# EAGLE design radio (EAGLE 5.11)
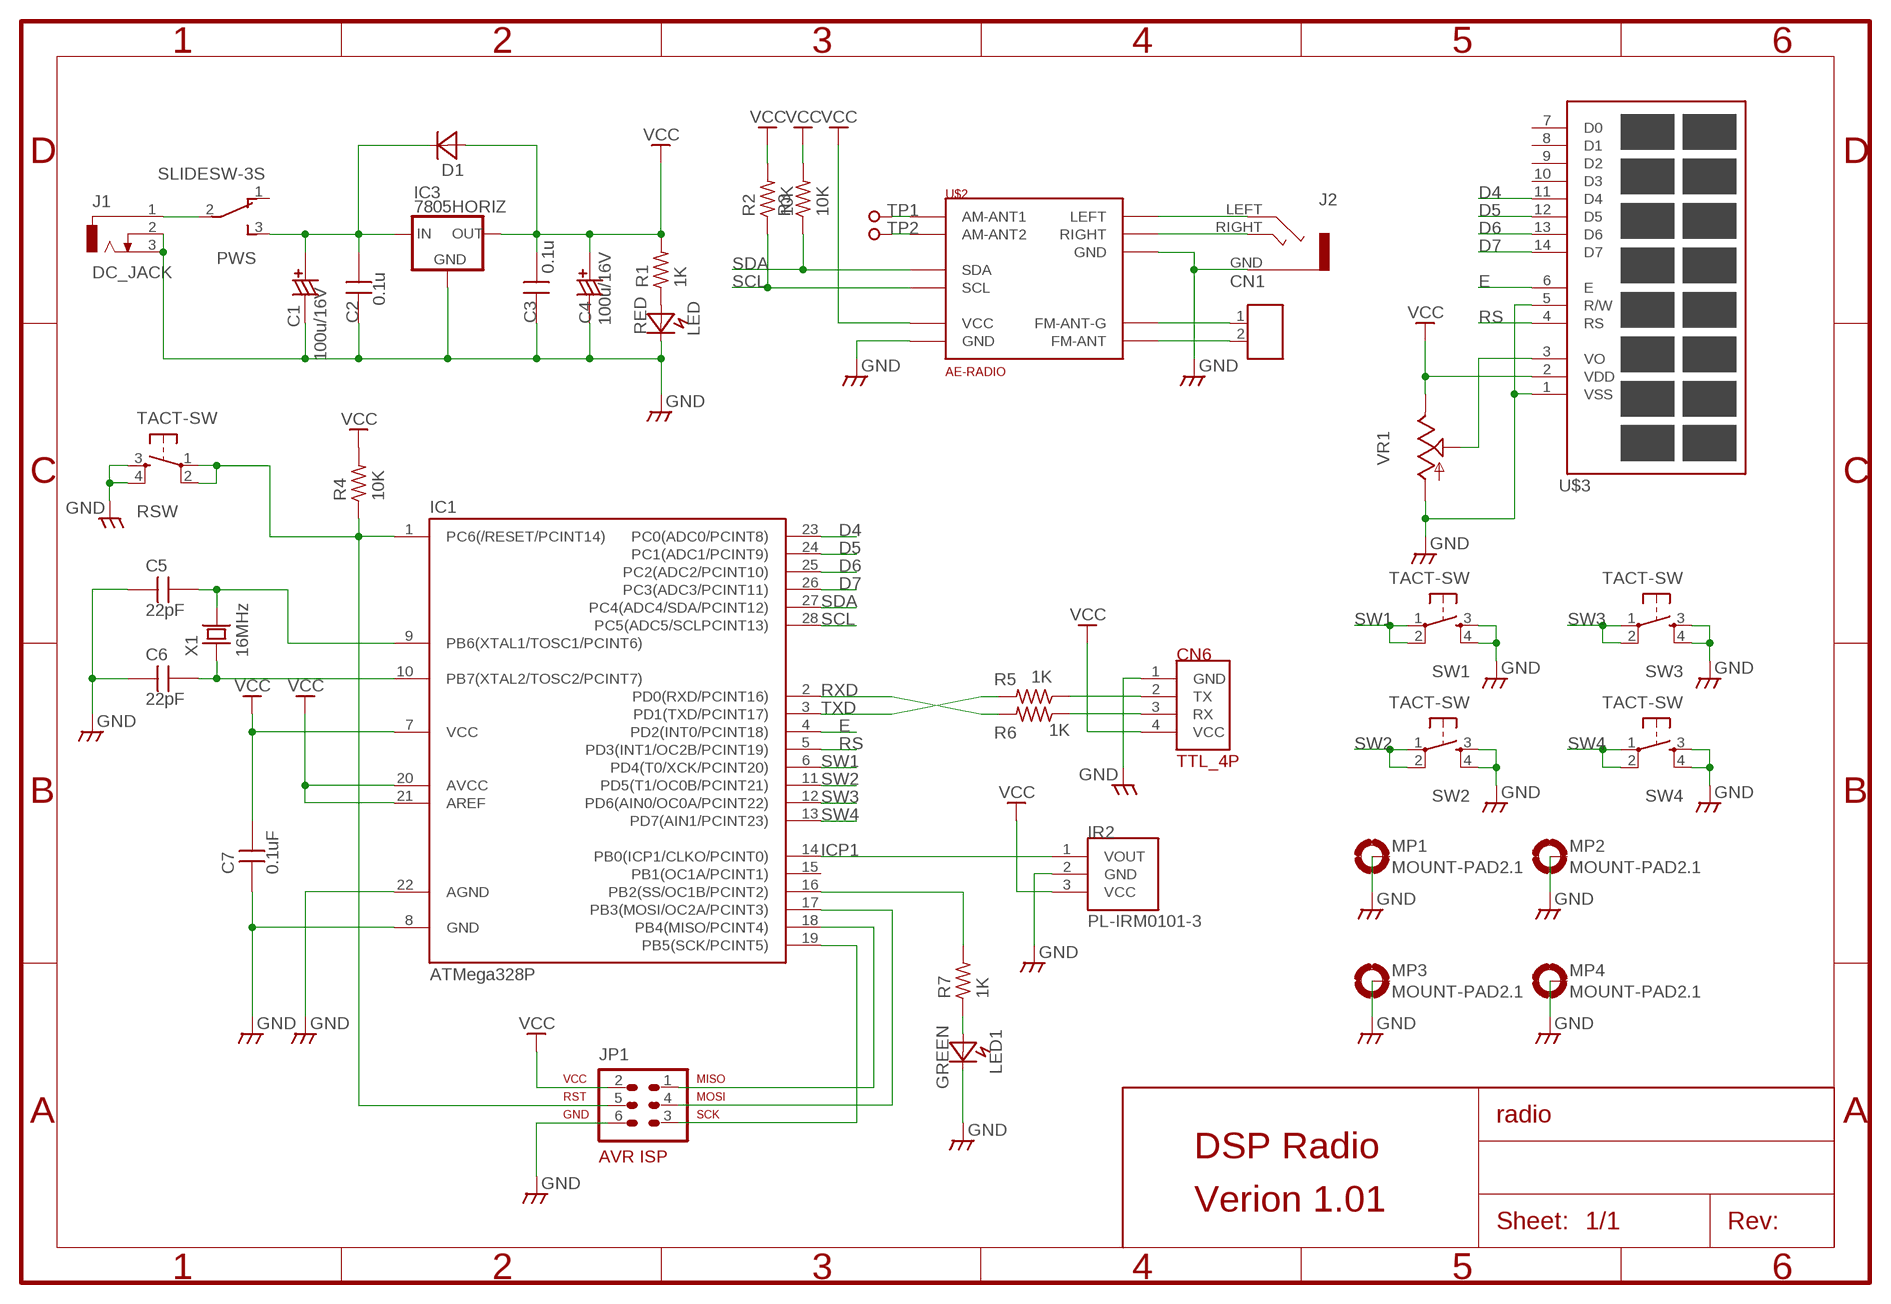
[diagram p0: schematic, sheet 1]

## Parts
C1  100u/16V  CCAP6.5  [CCAP_6.5]
C2  0.1u  CAPDIP_1  [CAP_DIP_1]
C3  0.1u  CAPDIP_1  [CAP_DIP_1]
C4  100u/16V  CCAP6.5  [CCAP_6.5]
C5  22pF  CAPDIP_1  [CAP_DIP_1]
C6  22pF  CAPDIP_1  [CAP_DIP_1]
C7  0.1uF  CAPDIP_2  [CAP_DIP_2]
CN1  CON_2P  [CON_HRS_DIP_2]
CN6  TTL_4P  [CON_HRS_DIP_4]
D1  DIODEGENERIC_2  [DIODE_2]
IC1  ATMega328P  MEGA48/88/168/328-PU  [DIL28-3]
IC3  7805HORIZ  [TO220H]
IR2  PL-IRM0101-3  PL-IRM0208  [PL-IRM0208]
J1  DC_JACK  [DCJ0202]
J2  MINIJACK  [MINIJACK]
JP1  AVR-ISP-6  [AVR-ISP-6]
LED  RED  LED  [LED_3MM_VIRT_2]
LED1  GREEN  LED  [LED_3MM_VIRT_2]
MP1  MOUNT-PAD2.1  [PAD-2.1]
MP2  MOUNT-PAD2.1  [PAD-2.1]
MP3  MOUNT-PAD2.1  [PAD-2.1]
MP4  MOUNT-PAD2.1  [PAD-2.1]
PWS  SLIDESW-3S  [DS-3]
R1  1K  R0.125W_4P  [R_0.125W_4]
R2  10K  R0.125W_4P  [R_0.125W_4]
R3  10K  R0.125W_4P  [R_0.125W_4]
R4  10K  R0.125W_4P  [R_0.125W_4]
R5  1K  R0.125W_4P  [R_0.125W_4]
R6  1K  R0.125W_4P  [R_0.125W_4]
R7  1K  R0.125W_4P  [R_0.125W_4]
RSW  TACT-SW  [B3F-10X]
SW1  TACT-SW  [B3F-10X]
SW2  TACT-SW  [B3F-10X]
SW3  TACT-SW  [B3F-10X]
SW4  TACT-SW  [B3F-10X]
TP1  TP1R  [TP1]
TP2  TP1R  [TP1]
U$2  AE-RADIO  [AE-RADIO]
U$3  ACM0802C_2  [ACM0802C_2]
VR1  POTMIDDLE  [POT_MIDDLE]
X1  16MHz  XTAL49S  [HC49/S]

## Nets
D4: IC1.23(PC0(ADC0/PCINT8)) U$3.11(D4)
D5: IC1.24(PC1(ADC1/PCINT9)) U$3.12(D5)
D6: IC1.25(PC2(ADC2/PCINT10)) U$3.13(D6)
D7: IC1.26(PC3(ADC3/PCINT11)) U$3.14(D7)
E: IC1.4(PD2(INT0/PCINT18)) U$3.6(E)
GND: C1.- C2.1 C3.1 C4.- C5.1 C6.1 C7.1 CN6.1(GND) IC1.8(GND) IC1.22(AGND) IC3.2(GND) IR2.2(GND) J1.2 J1.3 J2.GND JP1.6 LED1.K LED.K MP1.B2,1(MOUNT) MP2.B2,1(MOUNT) MP3.B2,1(MOUNT) MP4.B2,1(MOUNT) RSW.3(S) RSW.4(S1) SW1.3(S) SW1.4(S1) SW2.3(S) SW2.4(S1) SW3.3(S) SW3.4(S1) SW4.3(S) SW4.4(S1) U$2.GND@1(GND) U$2.GND@2(GND) U$3.1(VSS) U$3.5(R/W) VR1.A
ICP1: IC1.14(PB0(ICP1/CLKO/PCINT0)) IR2.1(VOUT)
LEFT: J2.LEFT U$2.LEFT
N$1: LED1.A R7.1
N$2: IC1.16(PB2(SS/OC1B/PCINT2)) R7.2
N$5: J1.1 PWS.2(P)
N$6: C6.2 IC1.10(PB7(XTAL2/TOSC2/PCINT7)) X1.1
N$7: LED.A R1.1
N$8: C1.+ C2.2 D1.K IC3.1(IN) PWS.3(S)
N$9: CN6.2(TX) R5.1
N$10: C5.2 IC1.9(PB6(XTAL1/TOSC1/PCINT6)) X1.2
N$11: CN1.1 U$2.FM-ANT-G
N$12: CN6.3(RX) R6.1
N$13: CN1.2 U$2.FM-ANT
N$14: TP1.P$1 U$2.AM-ANT1
N$15: TP2.P$1 U$2.AM-ANT2
N$16: U$3.3(VO) VR1.S
N$21: IC1.19(PB5(SCK/PCINT5)) JP1.3
N$22: IC1.18(PB4(MISO/PCINT4)) JP1.1
N$23: IC1.17(PB3(MOSI/OC2A/PCINT3)) JP1.4
RESET: IC1.1(PC6(/RESET/PCINT14)) JP1.5 R4.1 RSW.1(P) RSW.2(P1)
RIGHT: J2.RIGHT U$2.RIGHT
RS: IC1.5(PD3(INT1/OC2B/PCINT19)) U$3.4(RS)
RXD: IC1.2(PD0(RXD/PCINT16)) R6.2
SCL: IC1.28(PC5(ADC5/SCLPCINT13)) R2.1 U$2.SCL
SDA: IC1.27(PC4(ADC4/SDA/PCINT12)) R3.1 U$2.SDA
SW1: IC1.6(PD4(T0/XCK/PCINT20)) SW1.1(P) SW1.2(P1)
SW2: IC1.11(PD5(T1/OC0B/PCINT21)) SW2.1(P) SW2.2(P1)
SW3: IC1.12(PD6(AIN0/OC0A/PCINT22)) SW3.1(P) SW3.2(P1)
SW4: IC1.13(PD7(AIN1/PCINT23)) SW4.1(P) SW4.2(P1)
TXD: IC1.3(PD1(TXD/PCINT17)) R5.2
VCC: C3.2 C4.+ C7.2 CN6.4(VCC) D1.A IC1.7(VCC) IC1.20(AVCC) IC1.21(AREF) IC3.3(OUT) IR2.3(VCC) JP1.2 R1.2 R2.2 R3.2 R4.2 U$2.VCC U$3.2(VDD) VR1.E
Unconnected: IC1.15(PB1(OC1A/PCINT1)) PWS.1(O) U$3.7(D0) U$3.8(D1) U$3.9(D2) U$3.10(D3)

## Notes on the sheet
- DSP Radio
- Verion 1.01

## Library data of the parts
C1 C4 = MyLib:CCAP: Polar capacitor
C2 C3 C5-C7 = MyLib:CAP: Non polar capacitor
CN1 = MyLib:CON_2P: 2P Molex Connector
CN6 = bant:TTL_4P
D1 = MyLib:DIODE: General Use Diode
IC1 = MyLib:MEGA48/88/168/328-PU
IC3 = MyLib:78*
IR2 = keinSoft-01:PL-IRM0208: IR Reciever module 38kHz Vcc= 4.5-5.5V
J1 = MyLib:DC_JACK: DC Jack with Switch
J2 = bant:MINIJACK: Stereo MiniJack
JP1 = MyLib:AVR-ISP-6: AVR ISP-6 Serial Programming Header
LED LED1 = MyLib:LED: 3mm LED
MP1-MP4 = MyLib:MOUNT-PAD: 2.1mm Mount Pad (Connectable to GND)
PWS = MyLib:SLIDESW-3: 3P Slide Switch
R1-R7 = MyLib:R: General Resiter 1/8W 1/4W 1/2W V/H
RSW SW1-SW4 = MyLib:TACT-SW: Tacticle Push Switch
TP1 TP2 = MyLib:TP1: 1 Pin Test Point
U$2 = bant:AE-RADIO
U$3 = lcd:ACM0802C_2: ACM0802C SERIES LCD MODULE
VR1 = MyLib:POT: Volume Trimmer Resister
X1 = Xtal:XTAL: Crystal Oscillator HC49U/S

## Board
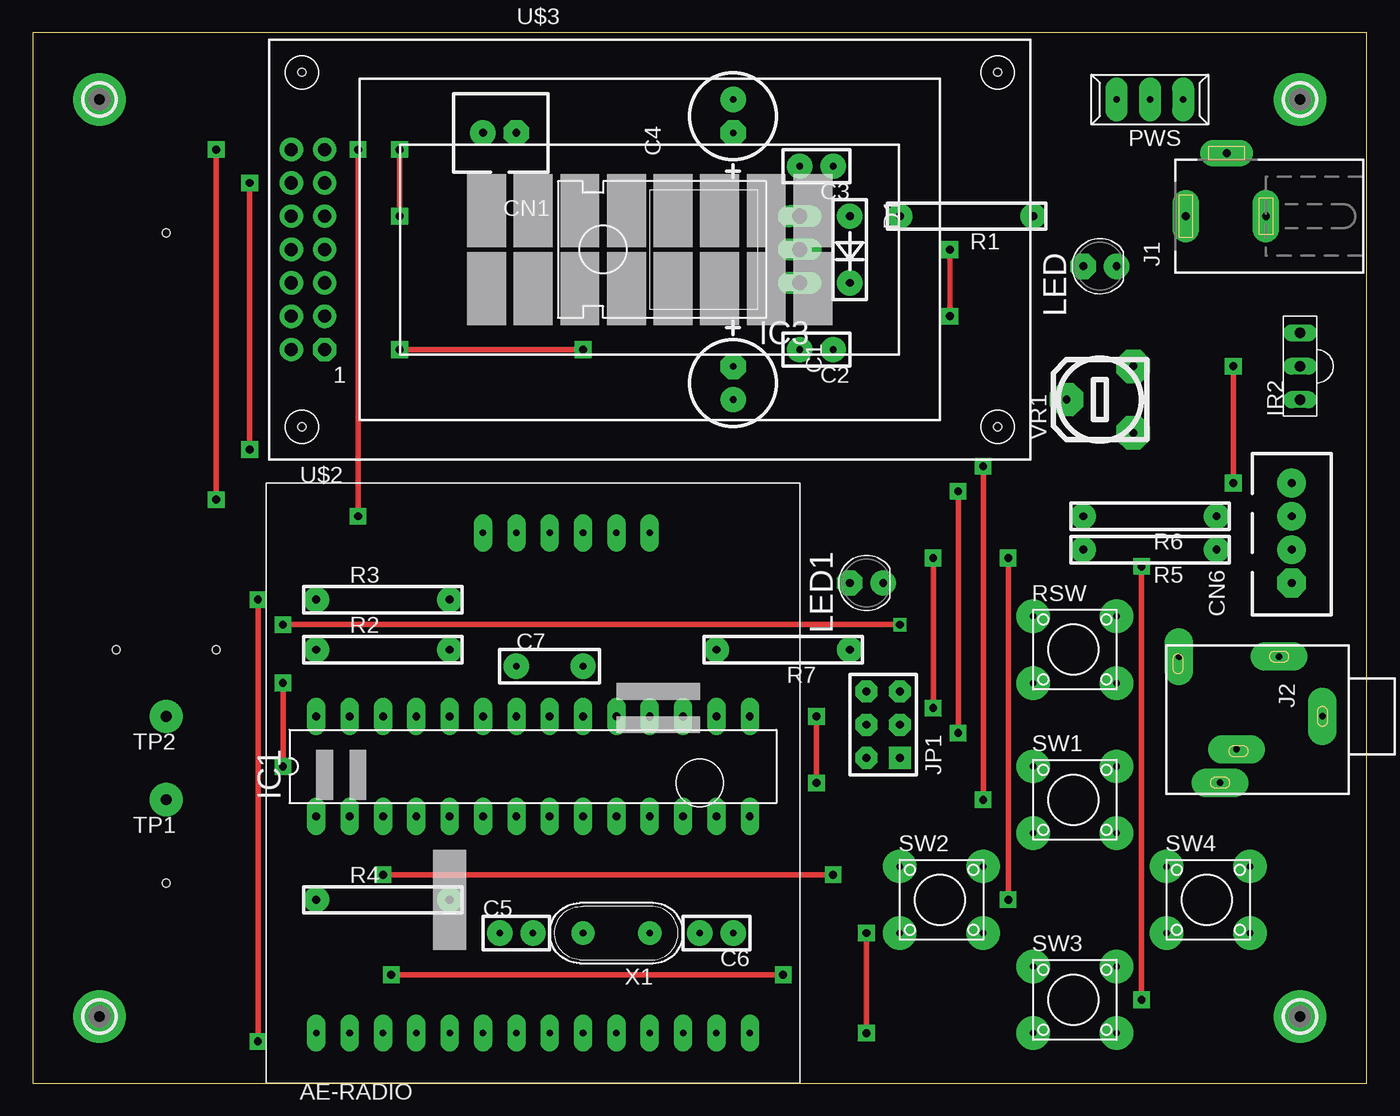
[diagram p1: board, top side]
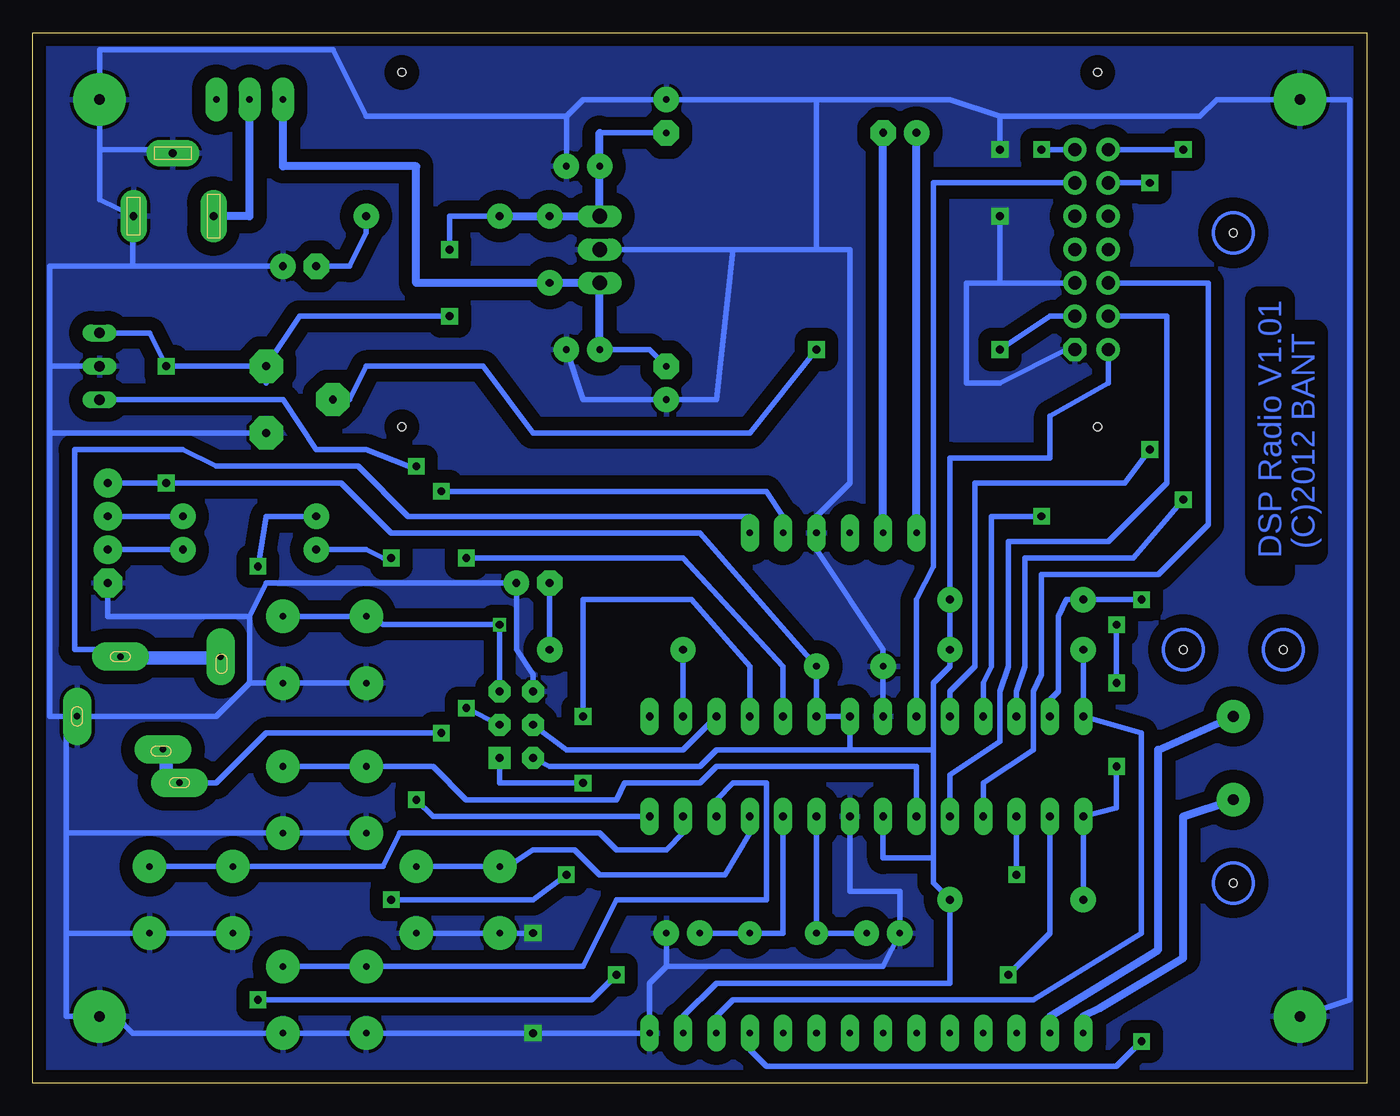
[diagram p2: board, bottom side, seen from below]

Size 101.6 x 80.01 mm. Coordinates in mm from the lower left corner, seen from the top.
Outline: 0,0 101.6,0 101.6,80.01 0,80.01 0,0
Copper layers (1*16): Top 0.035mm / dielectric 1.5mm / Bottom 0.035mm
Design rules "default": minimum track width 10mil, minimum drill 24mil, track to track 8mil, track to pad 8mil, pad to pad 8mil, via to via 8mil, smd to smd 8mil, copper to edge 40mil, drill to drill 8mil, minimum pad ring 10mil, minimum via ring 8mil, stop-mask expansion 4mil, vias tented up to drill 0mil, thermal gap 10mil
Holes 0.6 mm at 10.16,15.24 10.16,64.77 13.97,33.02 6.35,33.02

### Footprints (pad centres in the part's own frame; a part is rotated, then mirrored left to right if it is on the bottom)
CCAP_6.5 = drill 0.5 pad 1.93 octagon: + -1.27,0 | drill 0.5 pad 1.93 round: - 1.27,0
CAP_DIP_1 = drill 0.5 pad 1.93 round: 1 -1.27,0; 2 1.27,0
CAP_DIP_2 = drill 0.5 pad 1.93 round: 1 -2.54,0; 2 2.54,0
CON_HRS_DIP_2 = drill 0.6 pad 1.93 octagon: 1 -1.27,0 | drill 0.6 pad 1.93 round: 2 1.27,0
CON_HRS_DIP_4 = drill 0.6 pad 2.184 octagon: 1 -3.81,0 | drill 0.6 pad 2.184 round: 2 -1.27,0; 3 1.27,0; 4 3.81,0
DIODE_2 = drill 0.6 pad 1.93 round: A -2.54,0; K 2.54,0
DIL28-3 = drill 0.6 pad 1.422 long: 1 -16.51,-3.81; 2 -13.97,-3.81; 3 -11.43,-3.81; 4 -8.89,-3.81; 5 -6.35,-3.81; 6 -3.81,-3.81; 7 -1.27,-3.81; 8 1.27,-3.81; 9 3.81,-3.81; 10 6.35,-3.81; 11 8.89,-3.81; 12 11.43,-3.81; 13 13.97,-3.81; 14 16.51,-3.81; 15 16.51,3.81; 16 13.97,3.81; 17 11.43,3.81; 18 8.89,3.81; 19 6.35,3.81; 20 3.81,3.81; 21 1.27,3.81; 22 -1.27,3.81; 23 -3.81,3.81; 24 -6.35,3.81; 25 -8.89,3.81; 26 -11.43,3.81; 27 -13.97,3.81; 28 -16.51,3.81
TO220H = drill 1.118 long: 1 -2.54,-7.62; 2 0,-7.62; 3 2.54,-7.62
PL-IRM0208 = drill 0.8 long: 1 -2.54,0; 2 0,0; 3 2.54,0
DCJ0202 = drill 0.6 pad 2 long: 1 0,6.148; 2 4.8,3.048; 3 0,0.048
MINIJACK = drill 0.5 pad 2.184 long: GND 0,4.25; L2 -4.55,-6.67; LEFT -4.55,0.95; R2 2.51,-2.28; RIGHT 5.05,-3.55
AVR-ISP-6 = drill 0.6 pad 1.676 square: 1 -2.54,-1.27 | drill 0.6 pad 1.676 octagon: 2 -2.54,1.27; 3 0,-1.27; 4 0,1.27; 5 2.54,-1.27; 6 2.54,1.27
LED_3MM_VIRT_2 = drill 0.6 pad 1.93 octagon: A 0,1.27 | drill 0.6 pad 1.93 round: K 0,-1.27
PAD-2.1 = drill 0.8 pad 4 round: B2,1 0,0
DS-3 = drill 0.5 pad 1.676 long: 1 0,-2.54; 2 0,0; 3 0,2.54
R_0.125W_4 = drill 0.6 pad 1.93 round: 1 -5.08,0; 2 5.08,0
B3F-10X = drill 0.5 pad 2.54 round: 1 -1.27,2.54; 2 5.08,2.54; 3 -1.27,-2.54; 4 5.08,-2.54
TP1 = drill 0.813 pad 2.54 round: P$1 0,0
AE-RADIO = drill 0.5 pad 1.422 long: AM-ANT1 -16.51,-19.05; AM-ANT2 -13.97,-19.05; FM-ANT -3.81,19.05; FM-ANT-G -1.27,19.05; GND@1 16.51,-19.05; GND@2 3.81,19.05; LEFT 8.89,19.05; NC1 -11.43,-19.05; NC2 -8.89,-19.05; NC3 -6.35,-19.05; NC4 -3.81,-19.05; NC5 -1.27,-19.05; NC6 1.27,-19.05; NC7 3.81,-19.05; NC8 6.35,-19.05; NC9 1.27,19.05; RIGHT 6.35,19.05; SCL 11.43,-19.05; SDA 8.89,-19.05; VCC 13.97,-19.05
ACM0802C_2 = drill 1 pad 1.778 octagon: 1 -24.76,-7.62 | drill 1 pad 1.778 round: 2 -27.3,-7.62; 3 -24.76,-5.08; 4 -27.3,-5.08; 5 -24.76,-2.54; 6 -27.3,-2.54; 7 -24.76,0; 8 -27.3,0; 9 -24.76,2.54; 10 -27.3,2.54; 11 -24.76,5.08; 12 -27.3,5.08; 13 -24.76,7.62; 14 -27.3,7.62 | hole 0.6: -26.5,13.5; -26.5,-13.5; 26.5,-13.5; 26.5,13.5
POT_MIDDLE = drill 0.6 pad 2.54 octagon: A -2.54,-2.54; E 2.54,-2.54; S 0,2.54
HC49/S = drill 0.5 pad 1.778 round: 1 -2.54,0; 2 2.54,0

### Placement (x,y rotation side)
C1  53.34,53.34 270 top
C2  59.69,55.88 180 top
C3  59.69,69.85 180 top
C4  53.34,73.66 90 top
C5  36.83,11.43 0 top
C6  52.07,11.43 180 top
C7  39.37,31.75 0 top
CN1  35.56,72.39 180 top
CN6  95.89,41.91 90 top
D1  62.23,63.5 270 top
IC1  38.1,24.13 0 top
IC3  50.8,63.5 90 top
IR2  96.52,54.61 90 top
J1  93.98,66.04 90 top
J2  93.98,27.94 270 top
JP1  64.77,27.3 90 top
LED  81.28,62.23 90 top
LED1  63.5,38.1 90 top
MP1  5.08,74.93 0 top
MP2  5.08,5.08 90 top
MP3  96.52,5.08 0 top
MP4  96.52,74.93 0 top
PWS  85.09,74.93 90 top
R1  71.12,66.04 180 top
R2  26.67,33.02 0 top
R3  26.67,36.83 0 top
R4  26.67,13.97 0 top
R5  85.09,40.64 180 top
R6  85.09,43.18 180 top
R7  57.15,33.02 180 top
RSW  77.47,33.02 0 top
SW1  77.47,21.59 0 top
SW2  67.31,13.97 0 top
SW3  77.47,6.35 0 top
SW4  87.63,13.97 0 top
TP1  10.16,21.59 0 top
TP2  10.16,27.94 0 top
U$2  38.1,22.86 0 top
U$3  46.99,63.5 0 top
VR1  81.28,52.07 90 top
X1  44.45,11.43 180 top

### Tracks (layer width: path | path; a pad name or v marks a point on that pad's centre or on a via)
D4
  Bottom 0.406: IC1.23 34.29,36.83 33.02,39.37 33.02,68.58 U$3.11
D5  (via drill 0.6 pad 1.27)
  Top 0.406: v16.51,48.26 v16.51,68.58
  Bottom 0.406: v16.51,68.58 U$3.12 | v16.51,48.26 18.41,45.72 29.84,45.72 29.84,31.75 31.75,29.84 IC1.24
D6  (via drill 0.6 pad 1.27)
  Top 0.406: v24.77,43.18 v24.77,71.12
  Bottom 0.406: IC1.25 29.21,30.48 28.57,31.75 28.57,43.18 v24.77,43.18 | v24.77,71.12 U$3.13
D7  (via drill 0.6 pad 1.27)
  Top 0.406: v13.97,44.45 v13.97,71.12
  Bottom 0.406: IC1.26 26.67,29.84 26.04,31.75 26.04,40.01 17.78,40.01 v13.97,44.45 | v13.97,71.12 U$3.14
E
  Bottom 0.406: IC1.4 29.21,22.86 25.4,25.4 25.4,29.84 24.77,31.11 24.77,38.73 15.88,38.73 12.06,42.55 12.06,60.96 U$3.6
GND  (via drill 0.6 pad 1.27)
  Top 0.406: v27.94,71.12 v27.94,66.04 | v63.5,3.81 v63.5,11.43
  Bottom 0.254: J1.3 93.98,66.04 | J2.GND 99.06,27.94
  Bottom 0.406: IC1.22 C7.1 36.83,33.02 41.91,40.64 U$2.GND@2 41.91,43.18 39.37,45.72 39.37,63.5 41.91,63.5 | C2.1 59.69,52.07 C1.- 49.53,52.07 48.26,63.5 | RSW.3 RSW.4 85.09,30.48 | J1.2 91.44,71.12 96.52,71.12 | SW1.3 SW1.4 99.06,19.05 | 99.06,19.05 99.06,11.43 | 99.06,19.05 99.06,27.94 87.63,27.94 85.09,30.48 | J2.GND 100.33,27.94 100.33,49.53 | 93.98,62.23 100.33,62.23 100.33,54.61 | 93.98,62.23 LED.K | 93.98,66.04 93.98,62.23 | 96.52,71.12 MP4.B2,1 96.52,78.74 78.74,78.74 76.2,73.66 60.96,73.66 | 96.52,71.12 96.52,67.31 J1.3 | 60.96,73.66 59.69,74.93 C4.- 41.91,74.93 | 60.96,73.66 C3.1 | 100.33,54.61 100.33,49.53 | 100.33,49.53 VR1.A | 100.33,54.61 IR2.2 | 85.09,30.48 85.09,35.56 | 85.09,35.56 83.82,38.1 LED1.K 64.77,33.02 63.5,31.11 JP1.6 | MP2.B2,1 1.27,6.35 1.27,74.93 MP1.B2,1 11.43,74.93 12.7,73.66 27.94,73.66 | 53.34,8.89 36.83,8.89 C5.1 35.56,14.61 39.37,14.61 IC1.8 | 53.34,8.89 54.61,7.62 U$2.GND@1 v63.5,3.81 SW3.3 SW3.4 93.98,3.81 95.25,5.08 MP3.B2,1 99.06,5.08 99.06,11.43 | 53.34,8.89 C6.1 | SW2.4 SW2.3 v63.5,11.43 | SW4.3 SW4.4 99.06,11.43 | U$3.1 22.86,55.88 27.94,53.34 30.48,53.34 30.48,60.96 27.94,60.96 | 41.91,74.93 41.91,63.5 | 41.91,63.5 48.26,63.5 | 48.26,63.5 IC3.2 | CN6.1 95.89,35.56 85.09,35.56 | 27.94,60.96 U$3.5 | 27.94,73.66 31.75,74.93 41.91,74.93 | 27.94,73.66 v27.94,71.12 | v27.94,66.04 27.94,60.96
  pour Bottom (isolate 1.016): 0,80.01 0,0 101.6,0 101.6,1.27 101.6,80.01
ICP1  (via drill 0.6 pad 1.27)
  Top 0.406: v72.39,21.59 v72.39,46.99
  Bottom 0.406: IR2.1 82.55,52.07 80.01,48.26 76.2,48.26 73.03,46.99 v72.39,46.99 | IC1.14 71.12,20.32 v72.39,21.59
LEFT
  Bottom 0.406: U$2.LEFT 46.99,43.18 73.03,43.18 76.83,46.99 87.63,46.99 90.17,48.26 98.42,48.26 98.42,33.02 96.52,33.02 J2.LEFT
N$1
  Bottom 0.406: R7.1 LED1.A
N$2
  Bottom 0.406: IC1.16 R7.2
N$3
  Bottom 1.016: 87.63,32.38 94.61,32.38
N$4
  Bottom 1.016: 91.44,22.86 91.44,25.4
N$5
  Bottom 0.61: PWS.2 85.09,66.04 J1.1
N$6
  Bottom 0.406: IC1.10 44.45,11.43 X1.1 C6.2
N$7
  Bottom 0.406: LED.A 77.47,62.23 76.2,64.77 R1.1
N$8
  Bottom 0.406: C1.+ 54.61,55.88 C2.2
  Bottom 0.61: PWS.3 82.55,69.85 72.39,69.85 72.39,60.96 D1.K IC3.1 C2.2
N$9
  Bottom 0.406: R5.1 CN6.2
N$10
  Bottom 0.406: IC1.9 X1.2 C5.2
N$11
  Bottom 0.61: U$2.FM-ANT-G CN1.1
N$12
  Bottom 0.406: R6.1 CN6.3
N$13
  Bottom 0.61: U$2.FM-ANT CN1.2
N$14
  Bottom 0.61: TP1.P$1 13.97,20.32 13.97,9.53 20.32,5.71 21.59,5.08 U$2.AM-ANT1
N$15
  Bottom 0.61: U$2.AM-ANT2 24.13,5.08 15.88,10.16 15.88,25.4 TP2.P$1
N$16  (via drill 0.6 pad 1.27)
  Top 0.406: v27.94,55.88 v41.91,55.88
  Bottom 0.406: VR1.S 77.47,52.07 76.2,54.61 67.31,54.61 63.5,49.53 46.99,49.53 v41.91,55.88 | U$3.3 24.13,58.42 v27.94,55.88
N$21  (via drill 0.6 pad 1.27)
  Top 0.406: v68.58,40.01 v68.58,28.57
  Bottom 0.406: IC1.19 44.45,31.75 52.07,40.01 v68.58,40.01 | v68.58,28.57 JP1.3
N$22  (via drill 0.6 pad 1.27)
  Top 0.406: v59.69,27.94 v59.69,22.86
  Bottom 0.406: JP1.1 66.04,22.86 v59.69,22.86 | v59.69,27.94 59.69,36.83 51.44,36.83 46.99,31.75 IC1.18
N$23
  Bottom 0.406: IC1.17 52.07,25.4 60.96,25.4 JP1.4
RESET  (via drill 0.6, 0.6 pad 1.27)
  Top 0.406: v19.05,24.13 v19.05,30.48 | v19.05,34.92 v66.04,34.92
  Bottom 0.406: R4.1 IC1.1 19.05,20.95 v19.05,24.13 | JP1.5 v66.04,34.92 74.93,34.92 RSW.1 RSW.2 | v19.05,30.48 v19.05,34.92
RIGHT  (via drill 0.6 pad 1.27)
  Top 0.406: v70.48,45.09 v70.48,26.67
  Bottom 0.406: J2.RIGHT 87.63,22.89 87.63,22.86 83.82,26.67 v70.48,26.67 | v70.48,45.09 45.72,45.09 44.45,43.18 U$2.RIGHT
RS
  Bottom 0.406: IC1.5 31.75,23.5 27.94,26.04 27.94,29.84 27.3,31.75 27.3,41.27 19.68,41.27 15.24,45.72 15.24,58.42 U$3.4
RXD  (via drill 0.6 pad 1.27)
  Top 0.406: v84.45,6.35 v84.45,39.37 | v27.3,8.26 v57.15,8.26
  Bottom 0.406: v84.45,39.37 83.82,43.18 R6.2 | v84.45,6.35 59.05,6.35 v57.15,8.26 | v27.3,8.26 24.13,11.43 IC1.2
SCL
  Bottom 0.406: U$2.SCL 49.53,5.08 48.26,6.35 25.4,6.35 17.14,11.43 17.14,26.67 IC1.28 R2.1
SDA  (via drill 0.6 pad 1.27)
  Top 0.406: v17.14,3.17 v17.14,36.83
  Bottom 0.406: IC1.27 24.13,29.21 23.5,29.84 23.5,35.56 22.86,36.83 R3.1 v17.14,36.83 | U$2.SDA 46.99,2.54 45.72,1.27 19.05,1.27 v17.14,3.17
SW1
  Bottom 0.406: IC1.6 34.29,24.13 49.53,24.13 50.8,22.86 56.52,22.86 57.15,21.59 68.58,21.59 71.12,24.13 SW1.1 SW1.2
SW2
  Bottom 0.254: 65.41,16.51 SW2.1
  Bottom 0.406: IC1.11 46.99,19.05 48.9,15.88 58.42,15.88 60.33,17.78 63.5,17.78 65.41,16.51 | SW2.1 SW2.2
SW3
  Bottom 0.406: IC1.12 49.53,21.59 48.26,22.86 45.72,22.86 45.72,13.97 57.15,13.97 59.69,8.89 SW3.1 SW3.2
SW4
  Bottom 0.406: IC1.13 52.07,19.05 53.34,17.78 57.15,17.78 58.42,19.05 73.66,19.05 74.93,16.51 SW4.1 SW4.2
TXD  (via drill 0.6 pad 1.27)
  Top 0.406: v74.3,13.97 v74.3,40.01 | v26.67,15.88 v60.96,15.88
  Bottom 0.406: v74.3,40.01 74.93,40.01 76.2,40.64 R5.2 | v74.3,13.97 63.5,13.97 v60.96,15.88 | v26.67,15.88 IC1.3
VCC  (via drill 0.6 pad 1.27)
  Top 0.406: v69.85,58.42 v69.85,63.5 | v91.44,45.72 v91.44,54.61
  Bottom 0.254: 52.07,5.08 U$2.VCC
  Bottom 0.406: 33.02,17.14 36.83,17.14 IC1.7 | 33.02,17.14 33.02,15.24 R4.2 31.75,7.62 49.53,7.62 52.07,5.08 | 33.02,17.14 33.02,25.4 | 33.02,25.4 39.37,25.4 | 39.37,25.4 IC1.21 IC1.20 C7.2 50.8,41.91 74.3,41.91 78.11,45.72 v91.44,45.72 CN6.4 | 33.02,25.4 33.02,30.48 31.75,31.75 R2.2 R3.2 31.75,47.62 24.13,47.62 24.13,50.8 19.68,53.34 U$3.2 | 58.42,72.39 C4.+ | JP1.2 62.23,24.13 50.8,24.13 49.53,25.4 39.37,25.4 | IR2.3 92.71,57.15 v91.44,54.61 VR1.E | VR1.E 81.28,58.42 v69.85,58.42 | VR1.E 83.82,53.34 | R1.2 69.85,66.04 v69.85,63.5
  Bottom 0.61: 58.42,72.39 C3.2 IC3.3 D1.A R1.2
(copper drawn outside any net)
  shapes: Bottom circle x4

### Text on the board
Bottom: DSP Radio V1.01 | (C)2012 BANT